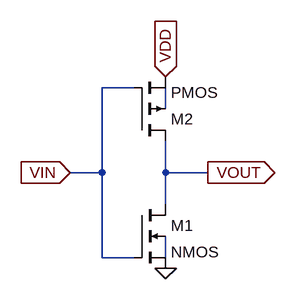
[diagram p0: schematic not.asc]
not.asc, the LTspice schematic file:
Version 4
SHEET 1 1208 680
WIRE 640 80 592 80
WIRE 688 112 688 80
WIRE 592 208 592 80
WIRE 592 208 544 208
WIRE 688 208 688 160
WIRE 752 208 688 208
WIRE 688 256 688 208
WIRE 592 336 592 208
WIRE 640 336 592 336
WIRE 688 336 688 304
FLAG 544 208 VIN
IOPIN 544 208 In
FLAG 752 208 VOUT
IOPIN 752 208 Out
FLAG 688 352 0
FLAG 688 64 VDD
IOPIN 688 64 In
SYMBOL nmos4 640 256 R0
SYMATTR InstName M1
SYMATTR Value2 l=90n w=200n
SYMBOL pmos4 640 160 M180
SYMATTR InstName M2
SYMATTR Value2 l=90n w=400n

The netlist it stands for:
* not.asc
M1 VOUT VIN 0 N002 NMOS l=90n w=200n
M2 VOUT VIN VDD N001 PMOS l=90n w=400n
.model NMOS NMOS
.model PMOS PMOS
.lib standard.mos
.backanno
.end